# EAGLE design IN-16 Display (EAGLE 9.6.2)
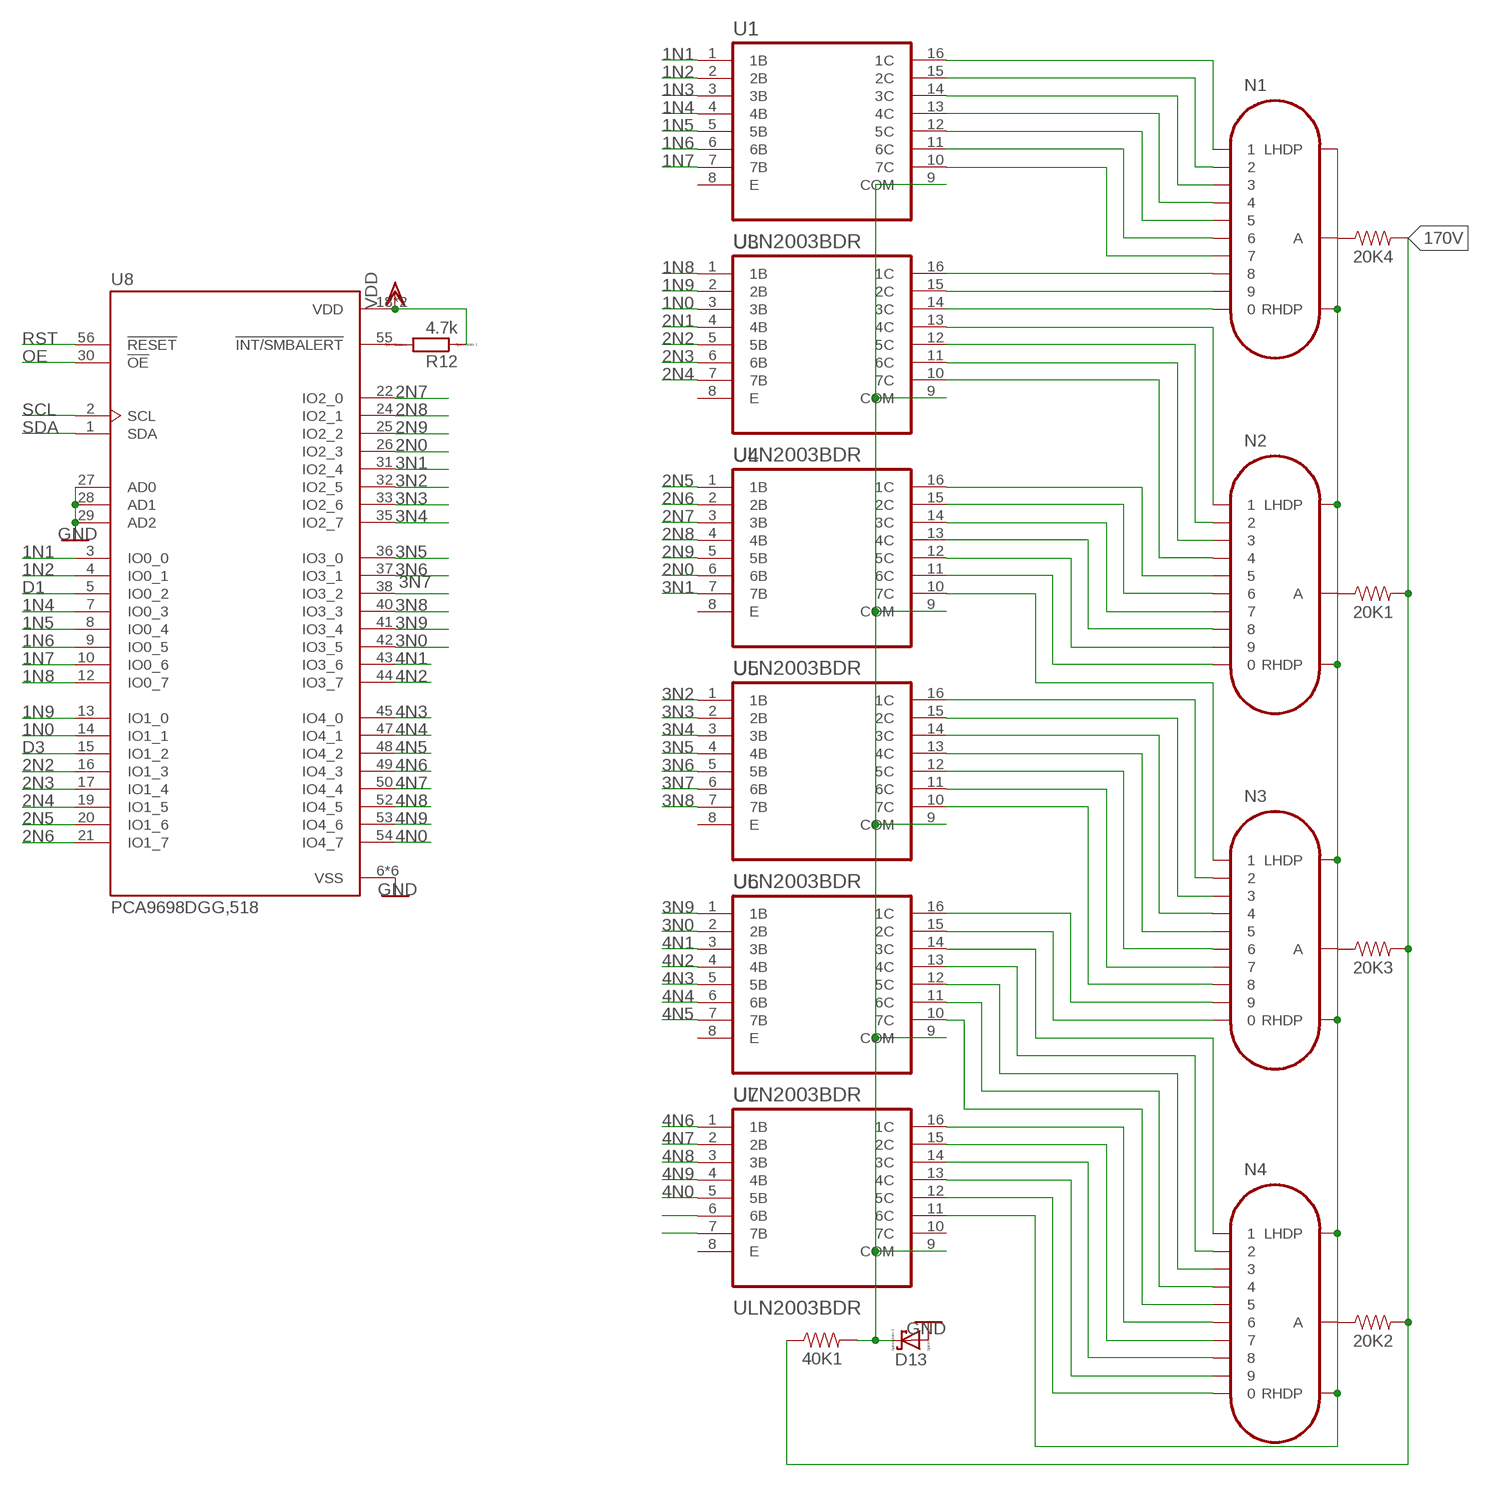
[diagram p0: schematic, sheet 1, part 1 of 2]
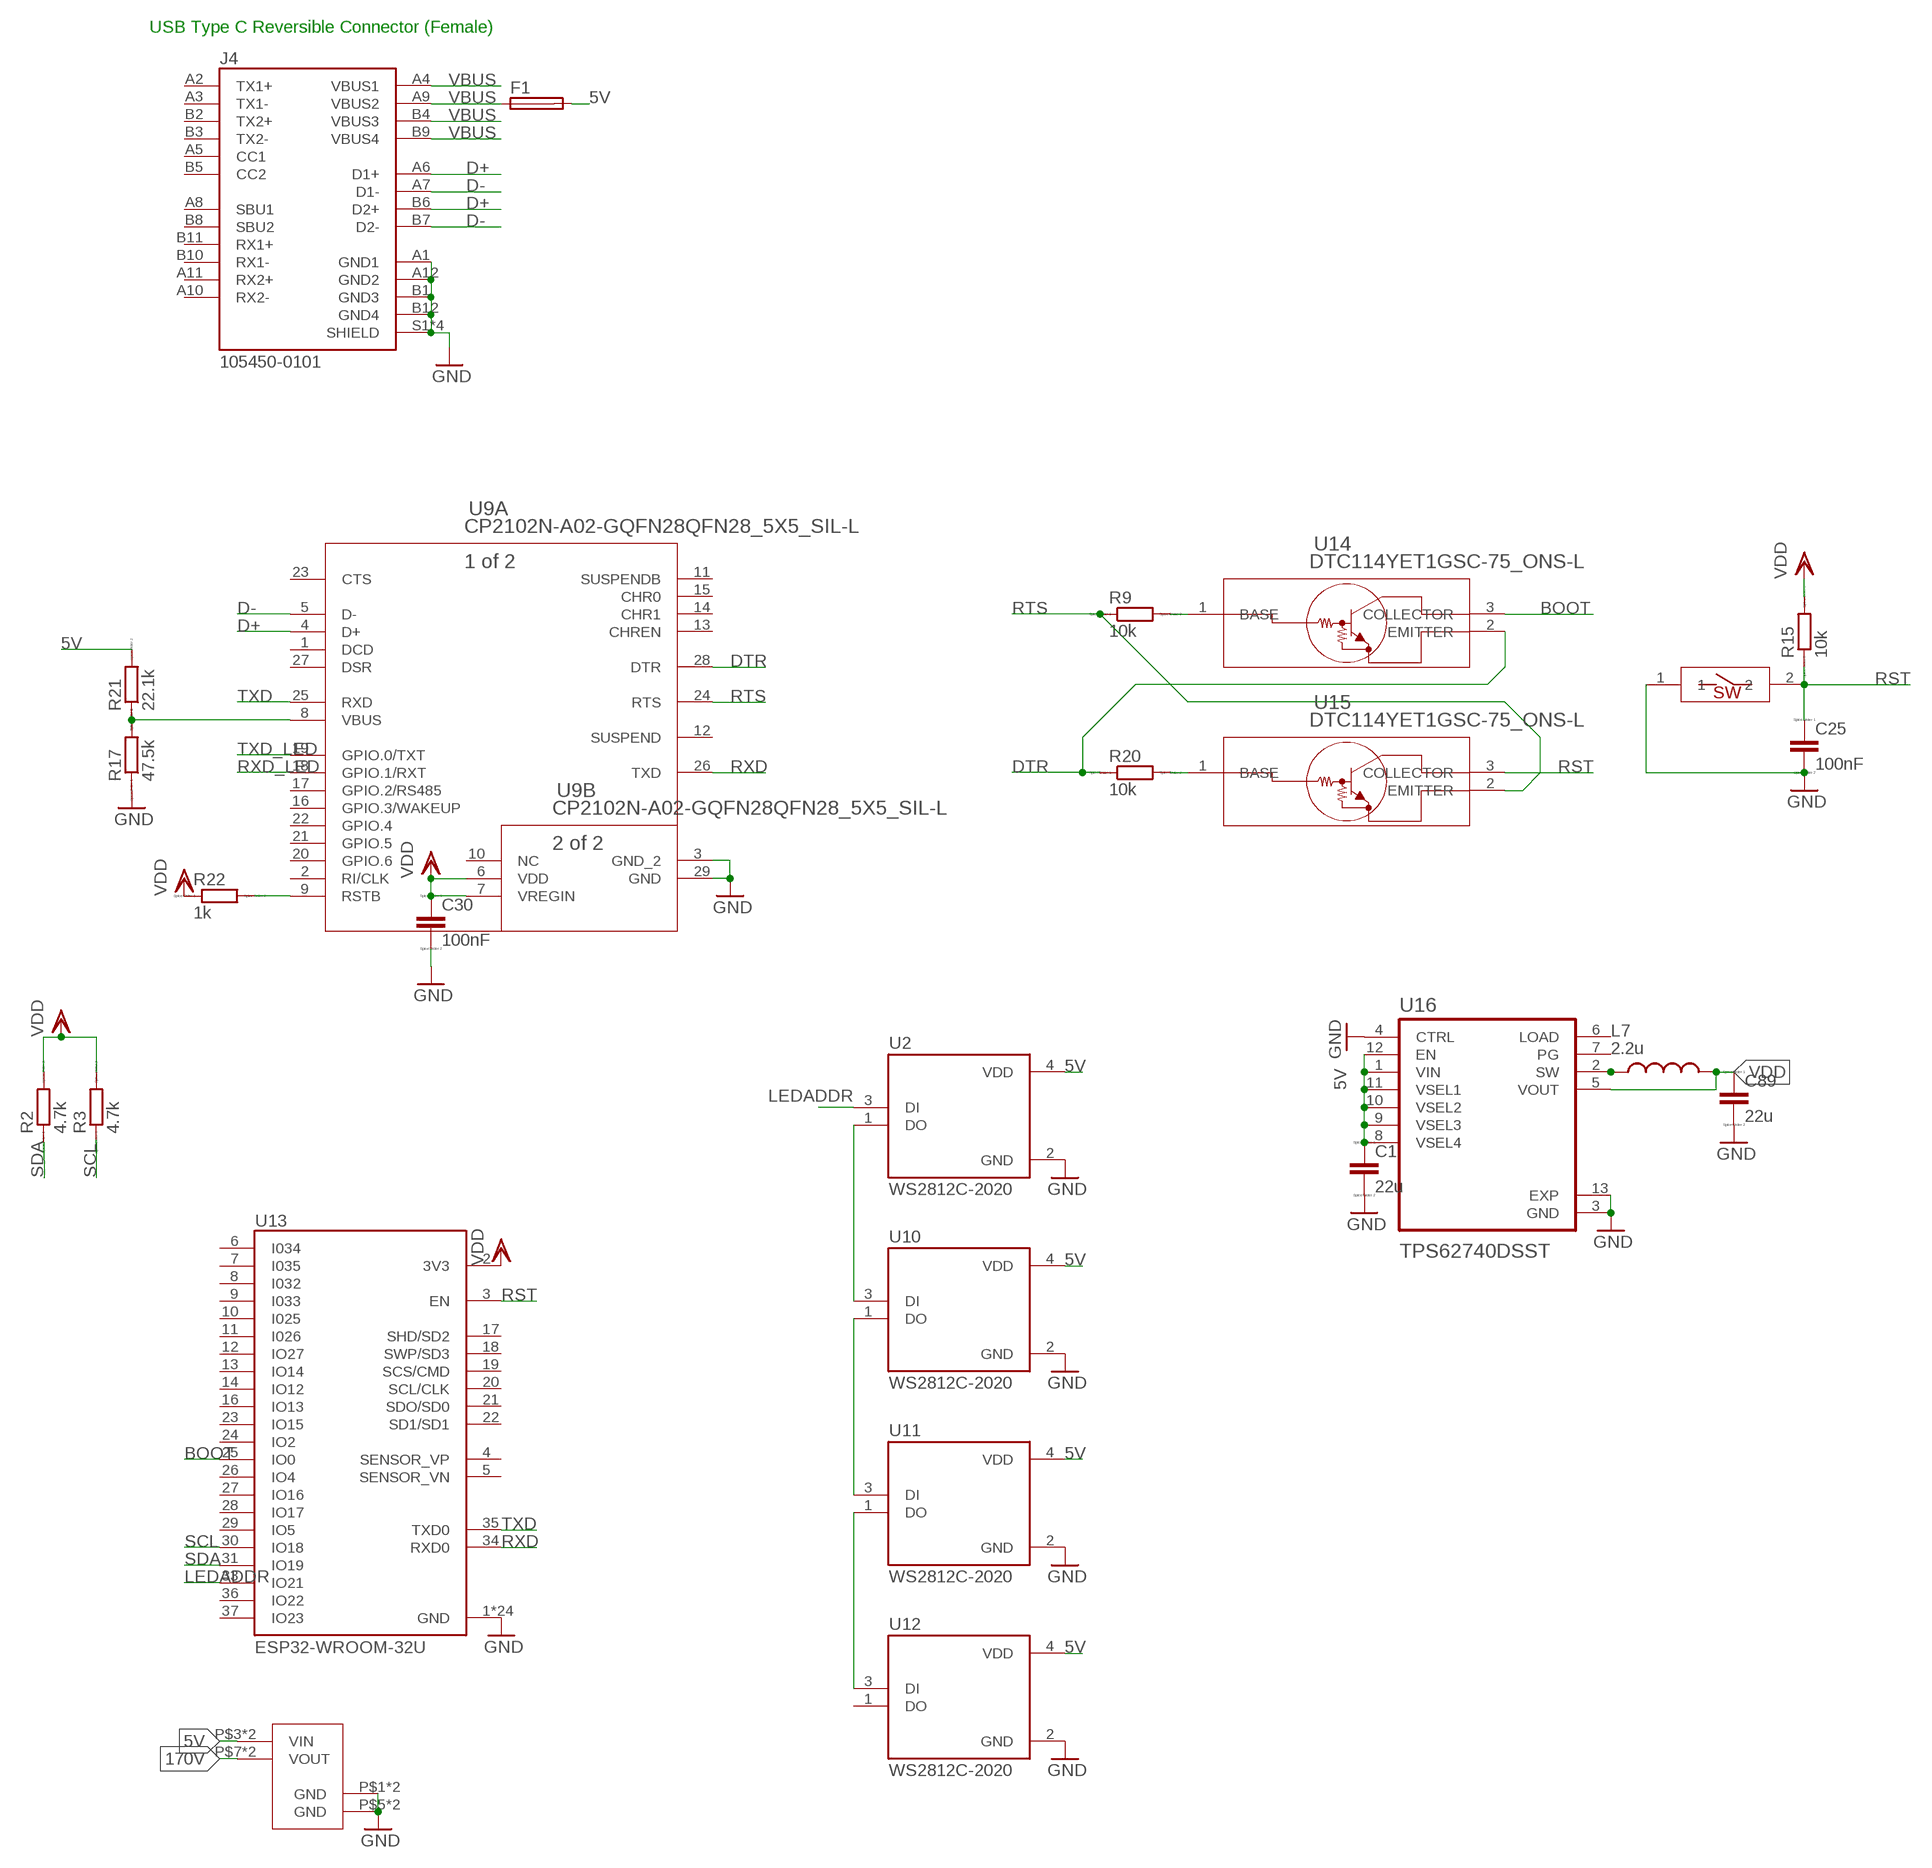
[diagram p1: schematic, sheet 1, part 2 of 2]

## Parts
20K1  0.05  0.1OHM-1210-1/2W-1%  [1210]
20K2  0.05  0.1OHM-1210-1/2W-1%  [1210]
20K3  0.05  0.1OHM-1210-1/2W-1%  [1210]
20K4  0.05  0.1OHM-1210-1/2W-1%  [1210]
40K1  0.05  0.1OHM-1210-1/2W-1%  [1210]
C1  22u  CC0603R  [C0603R]
C25  100nF  CC0402  [C0402]
C30  100nF  CC0402  [C0402]
C89  22u  CC0603R  [C0603R]
D13  SCHOTTKY-DIODE  [DIODE_SMB]
F1  MF-MSMF050-2  [1812]
J4  105450-0101  [MOLEX_105450-0101]
L7  2.2u  1277AS-H-1R5M=P2  [INDC3225X120N]
N1  IN-16  [IN-16]
N2  IN-16  [IN-16]
N3  IN-16  [IN-16]
N4  IN-16  [IN-16]
R2  4.7k  RR0402  [R0402]
R3  4.7k  RR0402  [R0402]
R9  10k  RR0402  [R0402]
R12  4.7k  RR0402  [R0402]
R15  10k  RR0402  [R0402]
R17  47.5k  RR0402  [R0402]
R20  10k  RR0402  [R0402]
R21  22.1k  RR0402  [R0402]
R22  1k  RR0402  [R0402]
RESET  SMDSWITCH  [RESC4217X170]
U1  ULN2003BDR  [SOIC127P600X175-16N]
U2  WS2812C-2020  [LED_WS2812C-2020]
U3  ULN2003BDR  [SOIC127P600X175-16N]
U4  ULN2003BDR  [SOIC127P600X175-16N]
U5  ULN2003BDR  [SOIC127P600X175-16N]
U6  ULN2003BDR  [SOIC127P600X175-16N]
U7  ULN2003BDR  [SOIC127P600X175-16N]
U8  PCA9698DGG,518  [SOP50P810X120-56N]
U9  CP2102N-A02-GQFN28QFN28_5X5_SIL-L  [QFN28_5X5_SIL-L]
U10  WS2812C-2020  [LED_WS2812C-2020]
U11  WS2812C-2020  [LED_WS2812C-2020]
U12  WS2812C-2020  [LED_WS2812C-2020]
U13  ESP32-WROOM-32U  [XCVR_ESP32-WROOM-32U]
U14  DTC114YET1GSC-75_ONS-L  [SC-75_ONS-L]
U15  DTC114YET1GSC-75_ONS-L  [SC-75_ONS-L]
U16  TPS62740DSST  [VREG_LM27762DSSR]
U$1  HVPSU  [HVPSU]

## Nets
1N0: U3.3(3B) U8.14(IO1_1)
1N1: U1.1(1B) U8.3(IO0_0)
1N2: U1.2(2B) U8.4(IO0_1)
1N3: U1.3(3B)
1N4: U1.4(4B) U8.7(IO0_3)
1N5: U1.5(5B) U8.8(IO0_4)
1N6: U1.6(6B) U8.9(IO0_5)
1N7: U1.7(7B) U8.10(IO0_6)
1N8: U3.1(1B) U8.12(IO0_7)
1N9: U3.2(2B) U8.13(IO1_0)
2N0: U4.6(6B) U8.26(IO2_3)
2N1: U3.4(4B)
2N2: U3.5(5B) U8.16(IO1_3)
2N3: U3.6(6B) U8.17(IO1_4)
2N4: U3.7(7B) U8.19(IO1_5)
2N5: U4.1(1B) U8.20(IO1_6)
2N6: U4.2(2B) U8.21(IO1_7)
2N7: U4.3(3B) U8.22(IO2_0)
2N8: U4.4(4B) U8.24(IO2_1)
2N9: U4.5(5B) U8.25(IO2_2)
3N0: U6.2(2B) U8.42(IO3_5)
3N1: U4.7(7B) U8.31(IO2_4)
3N2: U5.1(1B) U8.32(IO2_5)
3N3: U5.2(2B) U8.33(IO2_6)
3N4: U5.3(3B) U8.35(IO2_7)
3N5: U5.4(4B) U8.36(IO3_0)
3N6: U5.5(5B) U8.37(IO3_1)
3N7: U5.6(6B) U8.38(IO3_2)
3N8: U5.7(7B) U8.40(IO3_3)
3N9: U6.1(1B) U8.41(IO3_4)
4N0: U7.5(5B) U8.54(IO4_7)
4N1: U6.3(3B) U8.43(IO3_6)
4N2: U6.4(4B) U8.44(IO3_7)
4N3: U6.5(5B) U8.45(IO4_0)
4N4: U6.6(6B) U8.47(IO4_1)
4N5: U6.7(7B) U8.48(IO4_2)
4N6: U7.1(1B) U8.49(IO4_3)
4N7: U7.2(2B) U8.50(IO4_4)
4N8: U7.3(3B) U8.52(IO4_5)
4N9: U7.4(4B) U8.53(IO4_6)
5V: C1.1 F1.2 R21.2 U2.4(VDD) U10.4(VDD) U11.4(VDD) U12.4(VDD) U16.1(VIN) U16.8(VSEL4) U16.9(VSEL3) U16.10(VSEL2) U16.11(VSEL1) U16.12(EN) U$1.P$3(VIN) U$1.P$4(VIN)
170V: 20K1.2 20K2.2 20K3.2 20K4.2 40K1.1 U$1.P$7(VOUT) U$1.P$8(VOUT)
BOOT: U13.25(IO0) U14.3(COLLECTOR)
D1: U8.5(IO0_2)
D3: U8.15(IO1_2)
D+: J4.A6(D1+) J4.B6(D2+) U9.4(A:D+)
D-: J4.A7(D1-) J4.B7(D2-) U9.5(A:D-)
DTR: R20.1 U9.28(A:DTR) U14.2(EMITTER)
GND: C1.2 C25.2 C30.2 C89.2 D13.A(C) J4.A1(GND1) J4.A12(GND2) J4.B1(GND3) J4.B12(GND4) J4.S1(SHIELD) J4.S2(SHIELD) J4.S3(SHIELD) J4.S4(SHIELD) R17.1 RESET.1 U2.2(GND) U8.6(VSS) U8.11(VSS) U8.23(VSS) U8.27(AD0) U8.28(AD1) U8.29(AD2) U8.34(VSS) U8.39(VSS) U8.51(VSS) U9.3(B:GND_2) U9.29(B:GND) U10.2(GND) U11.2(GND) U12.2(GND) U13.1(GND) U13.15(GND) U13.38(GND) U13.G.1(GND) U13.G.2(GND) U13.G.4(GND) U13.G.5(GND) U13.G.6(GND) U13.G.7(GND) U13.G.8(GND) U13.G.9(GND) U13.G.10(GND) U13.G.11(GND) U13.G.12(GND) U13.G.13(GND) U13.G.14(GND) U13.G.15(GND) U13.G.16(GND) U13.G.17(GND) U13.G.18(GND) U13.G.19(GND) U13.G.20(GND) U13.G.21(GND) U13.G.22(GND) U16.3(GND) U16.4(CTRL) U16.13(EXP) U$1.P$1(GND) U$1.P$2(GND) U$1.P$5(GND) U$1.P$6(GND)
LEDADDR: U2.3(DI) U13.33(IO21)
N$2 [170V]: N1.1 U1.16(1C)
N$3 [170V]: N1.2 U1.15(2C)
N$4 [170V]: N1.3 U1.14(3C)
N$5 [170V]: N1.4 U1.13(4C)
N$6 [170V]: N1.5 U1.12(5C)
N$7 [170V]: N1.6 U1.11(6C)
N$8 [170V]: N1.7 U1.10(7C)
N$9 [170V]: N1.8 U3.16(1C)
N$10 [170V]: N1.9 U3.15(2C)
N$11 [170V]: N1.0 U3.14(3C)
N$12 [170V]: N2.1 U3.13(4C)
N$13 [170V]: N2.2 U3.12(5C)
N$14 [170V]: N2.3 U3.11(6C)
N$15 [170V]: N2.4 U3.10(7C)
N$16 [170V]: N2.5 U4.16(1C)
N$17 [170V]: N2.6 U4.15(2C)
N$18 [170V]: N2.7 U4.14(3C)
N$19 [170V]: N2.8 U4.13(4C)
N$20: 20K4.1 N1.A
N$21 [170V]: N2.9 U4.12(5C)
N$22 [170V]: N2.0 U4.11(6C)
N$23 [170V]: N3.1 U4.10(7C)
N$24 [170V]: N3.2 U5.16(1C)
N$25 [170V]: N3.3 U5.15(2C)
N$26 [170V]: N3.4 U5.14(3C)
N$27 [170V]: N3.5 U5.13(4C)
N$28 [170V]: N3.6 U5.12(5C)
N$29 [170V]: N3.7 U5.11(6C)
N$30 [170V]: N3.8 U5.10(7C)
N$31 [170V]: N3.9 U6.16(1C)
N$32 [170V]: N3.0 U6.15(2C)
N$33 [170V]: N4.1 U6.14(3C)
N$34 [170V]: N4.2 U6.13(4C)
N$35 [170V]: N4.3 U6.12(5C)
N$36 [170V]: N4.4 U6.11(6C)
N$37 [170V]: N4.5 U6.10(7C)
N$38: R20.2 U15.1(BASE)
N$39 [170V]: N4.6 U7.16(1C)
N$40 [170V]: N4.7 U7.15(2C)
N$41 [170V]: N4.8 U7.14(3C)
N$42 [170V]: N4.9 U7.13(4C)
N$43 [170V]: N4.0 U7.12(5C)
N$44: 20K1.1 N2.A
N$45: 20K2.1 N4.A
N$46: 20K3.1 N3.A
N$47: R17.2 R21.1 U9.8(A:VBUS)
N$48: R22.2 U9.9(A:RSTB)
N$49: R9.2 U14.1(BASE)
N$50: U2.1(DO) U10.3(DI)
N$51: U10.1(DO) U11.3(DI)
N$52: U11.1(DO) U12.3(DI)
N$53: N1.LHDP N1.RHDP N2.LHDP N2.RHDP N3.LHDP N3.RHDP N4.LHDP N4.RHDP U7.11(6C)
N$67 [170V]: 40K1.2 D13.C(A) U1.9(COM) U3.9(COM) U4.9(COM) U5.9(COM) U6.9(COM) U7.9(COM)
N$80: L7.1 U16.2(SW)
N$85: U7.6(6B)
N$86: U7.7(7B)
N$95: R12.2 U8.55(!INT/SMBALERT)
OE: U8.30(!OE)
RST: C25.1 R15.1 RESET.2 U8.56(!RESET) U13.3(EN) U15.3(COLLECTOR)
RTS: R9.1 U9.24(A:RTS) U15.2(EMITTER)
RXD: U9.26(A:TXD) U13.34(RXD0)
RXD_LED: U9.18(A:GPIO.1/RXT)
SCL: R3.1 U8.2(SCL) U13.30(IO18)
SDA: R2.1 U8.1(SDA) U13.31(IO19)
TXD: U9.25(A:RXD) U13.35(TXD0)
TXD_LED: U9.19(A:GPIO.0/TXT)
VBUS: F1.1 J4.A4(VBUS1) J4.A9(VBUS2) J4.B4(VBUS3) J4.B9(VBUS4)
VDD: C30.1 C89.1 L7.2 R2.2 R3.2 R12.1 R15.2 R22.1 U8.18(VDD) U8.46(VDD) U9.6(B:VDD) U9.7(B:VREGIN) U13.2(3V3) U16.5(VOUT)
Unconnected: J4.A2(TX1+) J4.A3(TX1-) J4.A5(CC1) J4.A8(SBU1) J4.A10(RX2-) J4.A11(RX2+) J4.B2(TX2+) J4.B3(TX2-) J4.B5(CC2) J4.B8(SBU2) J4.B10(RX1-) J4.B11(RX1+) U1.8(E) U3.8(E) U4.8(E) U5.8(E) U6.8(E) U7.8(E) U7.10(7C) U9.1(A:DCD) U9.2(A:RI/CLK) U9.10(B:NC) U9.11(A:SUSPENDB) U9.12(A:SUSPEND) U9.13(A:CHREN) U9.14(A:CHR1) U9.15(A:CHR0) U9.16(A:GPIO.3/WAKEUP) U9.17(A:GPIO.2/RS485) U9.20(A:GPIO.6) U9.21(A:GPIO.5) U9.22(A:GPIO.4) U9.23(A:CTS) U9.27(A:DSR) U12.1(DO) U13.4(SENSOR_VP) U13.5(SENSOR_VN) U13.6(I034) U13.7(I035) U13.8(I032) U13.9(I033) U13.10(I025) U13.11(I026) U13.12(IO27) U13.13(IO14) U13.14(IO12) U13.16(IO13) U13.17(SHD/SD2) U13.18(SWP/SD3) U13.19(SCS/CMD) U13.20(SCL/CLK) U13.21(SDO/SD0) U13.22(SD1/SD1) U13.23(IO15) U13.24(IO2) U13.26(IO4) U13.27(IO16) U13.28(IO17) U13.29(IO5) U13.36(IO22) U13.37(IO23) U16.6(LOAD) U16.7(PG)

## Notes on the sheet
- USB Type C Reversible Connector (Female)

## Library data of the parts
20K1-20K4 40K1 = SparkFun-Resistors:0.1OHM: 0.1Ω resistor A resistor is a passive two-terminal electrical component that implements electrical resistance as a circuit element. Resistors act to reduce current flow, and, at the same time, act to lower voltage levels within circuits. - Wikipedia; PROD_ID: RES-12374; VALUE: 0.1
C1 C89 = eagle-ltspice:C: CAPACITOR, European symbol
C25 C30 = eagle-ltspice:C: CAPACITOR, European symbol; SPICEMODEL: NONE; SPICEPREFIX: C
D13 = eagle-ltspice:SCHOTTKY-DIODE: Schottky Diode; SPICEMODEL: NONE; SPICEPREFIX: D; SPICETYPE: diode
F1 = Thermistor_Inductors:MF-MSMF050-2: PTC RESET FUSE 15V 500MA 1812 Manufacturer's datasheet <https://www.bourns.com/docs/Product-Datasheets/mfmsmf.pdf>; CREATED_BY: PCBLayout.com; DIGIKEY_PART_NUMBER: MF-MSMF050-2TR-ND; MANUFACTURER: Bourns Inc.; MPN: MF-MSMF050-2; PACKAGE: 1812
J4 = 105450-0101:105450-0101: USB Shielded I/O Receptacle; Type C; Right Angle; Surface Mount; Gold over Nickel; AVAILABILITY: Unavailable; DESCRIPTION: USB-C (USB TYPE-C) USB 3.1 (USB 3.1 Gen 2, Superspeed+) Receptacle Connector 24 Position Surface Mount, Right Angle; Through Hole; MF: Molex; MP: 1054500101; PACKAGE: None; PRICE: None
L7 = 1277AS-H-1R5M_P2:1277AS-H-1R5M=P2: Ind Metal Alloy Shielded 1.5uH 20% 1MHz Powdered Iron 2.6A 1210 T/R Check prices <https://pricing.snapeda.com/parts/1277AS-H-1R5M%3DP2/Murata/view-part?ref=eda>; AVAILABILITY: Warning; DESCRIPTION: Inductor with Inductance: 1.5uH Tol. +/-20%, Package: 1210 (3225); MF: Murata; MP: 1277AS-H-1R5M=P2; PACKAGE: 1210 Murata; PRICE: None; PURCHASE-URL: https://pricing.snapeda.com/search/part/1277AS-H-1R5M=P2/?ref=eda
N1-N4 = russian-nixies:IN-16: IN-16: small numeric frontview nixie tube
R2 R3 R9 R12 R15 R17 R20-R22 = eagle-ltspice:R: RESISTOR, European symbol; SPICEMODEL: NONE; SPICEPREFIX: R
RESET = SMD SWITCH:SMDSWITCH
U1 U3-U7 = ULN2003BDR:ULN2003BDR: Check prices <https://pricing.snapeda.com/parts/ULN2003BDR/Texas%20Instruments/view-part?ref=eda>; AVAILABILITY: In Stock; DESCRIPTION: 50-V, 7-ch darlington array with 3-V input capability and low cost 16-SOIC -40 to 105; MF: Texas Instruments; MP: ULN2003BDR; PACKAGE: SOIC-16 Texas Instruments; PRICE: None; PURCHASE-URL: https://pricing.snapeda.com/search/part/ULN2003BDR/?ref=eda
U2 U10-U12 = WS2812C-2020:WS2812C-2020: Intelligent control LED integrated light source Check prices <https://pricing.snapeda.com/parts/WS2812C-2020/Worldsemi/view-part?ref=eda>; AVAILABILITY: Not in stock; DESCRIPTION: Intelligent control LED integrated light source; MF: Worldsemi; MP: WS2812C-2020; PACKAGE: Package; PRICE: None
U8 = PCA9698DGG_518:PCA9698DGG,518: PCA9698 - 40-bit Fm+ I2C-bus advanced I/O port with RESET, OE and INT Check prices <https://pricing.snapeda.com/parts/PCA9698DGG%2C518/NXP%20USA/view-part?ref=eda>; AVAILABILITY: Warning; DESCRIPTION: I/O Expander 40 I²C 1MHz 56-TSSOP; MF: NXP USA; MP: PCA9698DGG,518; PACKAGE: TSSOP-56 NXP Semiconductors; PRICE: None; PURCHASE-URL: https://pricing.snapeda.com/search/part/PCA9698DGG,518/?ref=eda
U9 = CP2102N:CP2102N-A02-GQFN28; BUILT_BY: EMA_Cory; COPYRIGHT: Copyright (C) 2018 Accelerated Designs. All rights reserved; DATASHEET: https://www.silabs.com/documents/public/data-sheets/cp2102n-datasheet.pdf; MANUFACTURER_PART_NUMBER: CP2102N-A02-GQFN28; SOURCELIBRARY: Silicon_Labs_2020-02-14; VENDOR: Silicon Labs
U13 = ESP32-WROOM-32U:ESP32-WROOM-32U: Wi-Fi/BT BLE Module ESP32-D0WD SPI Flash UART U.FL Conn. Check prices <https://pricing.snapeda.com/parts/ESP32-WROOM-32U/Espressif%20Systems/view-part?ref=eda>; AVAILABILITY: In Stock; DESCRIPTION: Bluetooth, WiFi 802.11b/g/n, Bluetooth v4.2 +EDR, Class 1, 2 and 3 Transceiver Module 2.4GHz ~ 2.5GHz Antenna Not Included, U.FL Surface Mount; MF: Espressif Systems; MP: ESP32-WROOM-32U; PACKAGE: Module Espressif Systems; PRICE: None; PURCHASE-URL: https://pricing.snapeda.com/search/part/ESP32-WROOM-32U/?ref=eda
U14 U15 = DTC114YET1G:DTC114YET1G; BUILT_BY: EMA_Justin; COPYRIGHT: Copyright (C) 2018 Accelerated Designs. All rights reserved; DATASHEET: https://www.onsemi.com/pub/Collateral/DTC114Y-D.PDF; MANUFACTURER_PART_NUMBER: DTC114YET1G; SOURCELIBRARY: ON_Semiconductor_2020-01-13; VENDOR: ON Semiconductor
U16 = TPS62740DSST:TPS62740DSST: Check prices <https://pricing.snapeda.com/parts/TPS62740DSS/Texas%20Instruments/view-part?ref=eda>; AVAILABILITY: In Stock; DESCRIPTION: DCS-Control™ Converter, Bluetooth (BLT) Voltage Regulator IC 1 Output 12-WSON (3x2); MF: Texas Instruments; MP: TPS62740DSS; PACKAGE: WSON-12 Texas Instruments; PRICE: None; PURCHASE-URL: https://pricing.snapeda.com/search/part/TPS62740DSS/?ref=eda
U$1 = HVPSU:HVPSU

## Net classes
1 170V: width 0.3 mm, drill 0.3 mm, clearance 0.2 mm

## Board
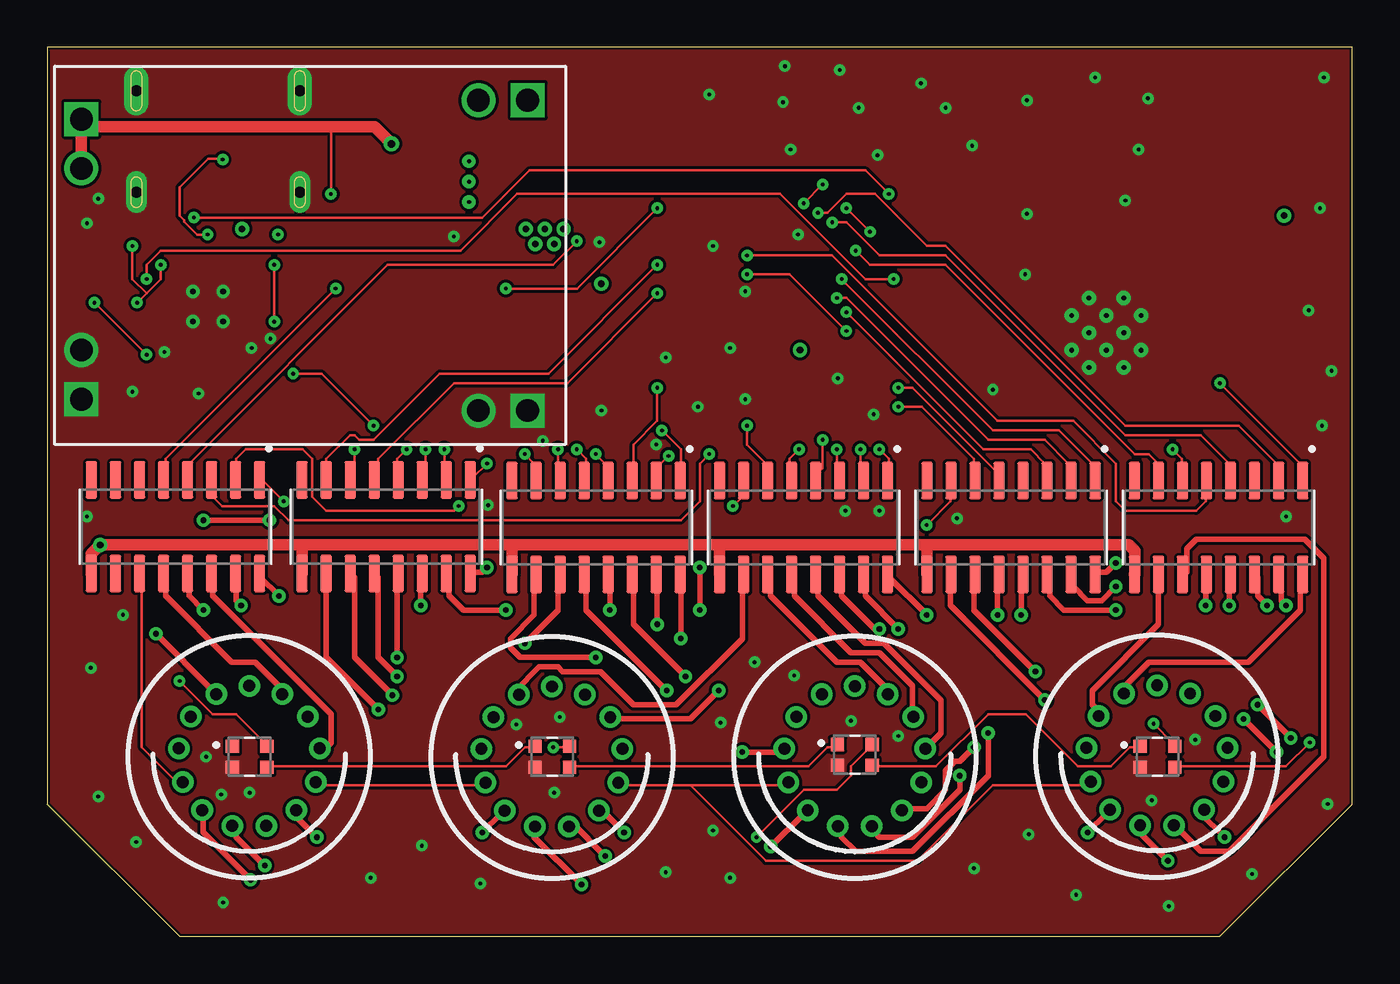
[diagram p2: board, top side]
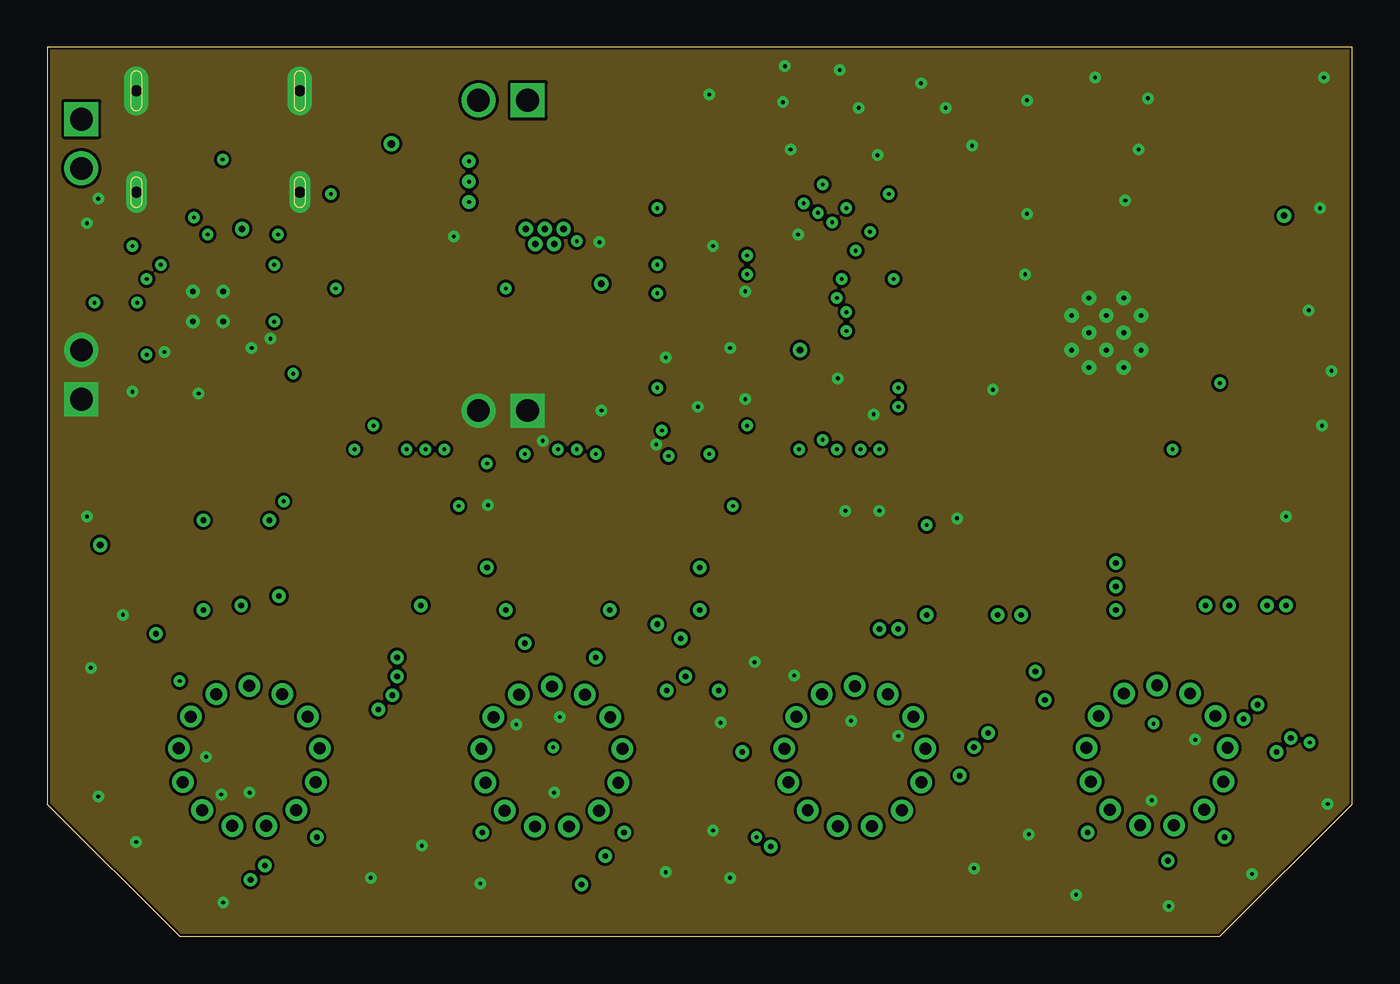
[diagram p3: board, inner layer Route2]
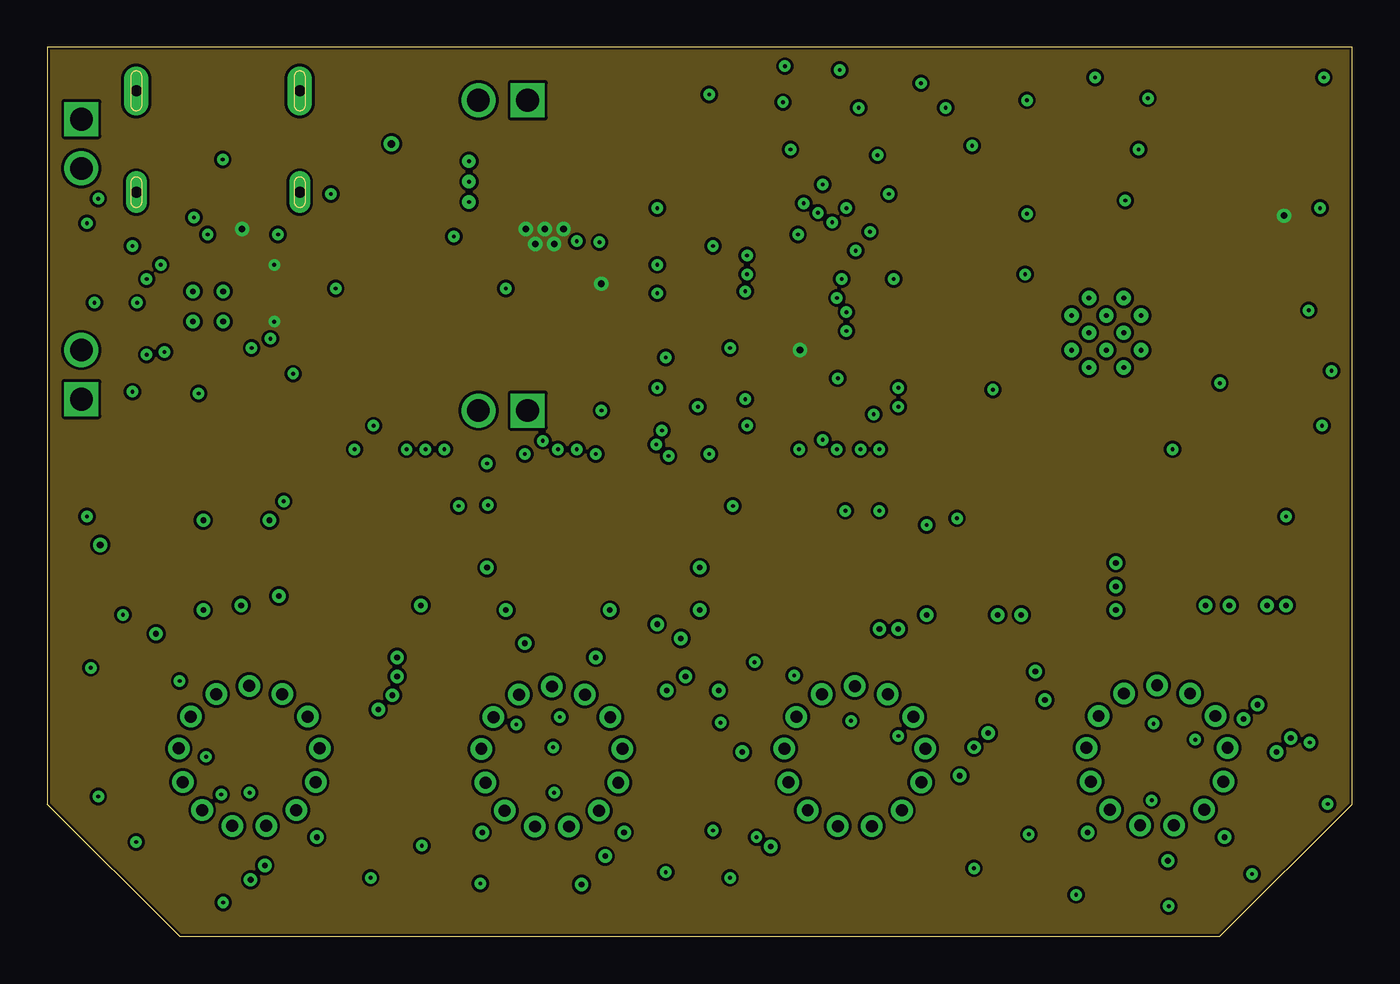
[diagram p4: board, inner layer Route15]
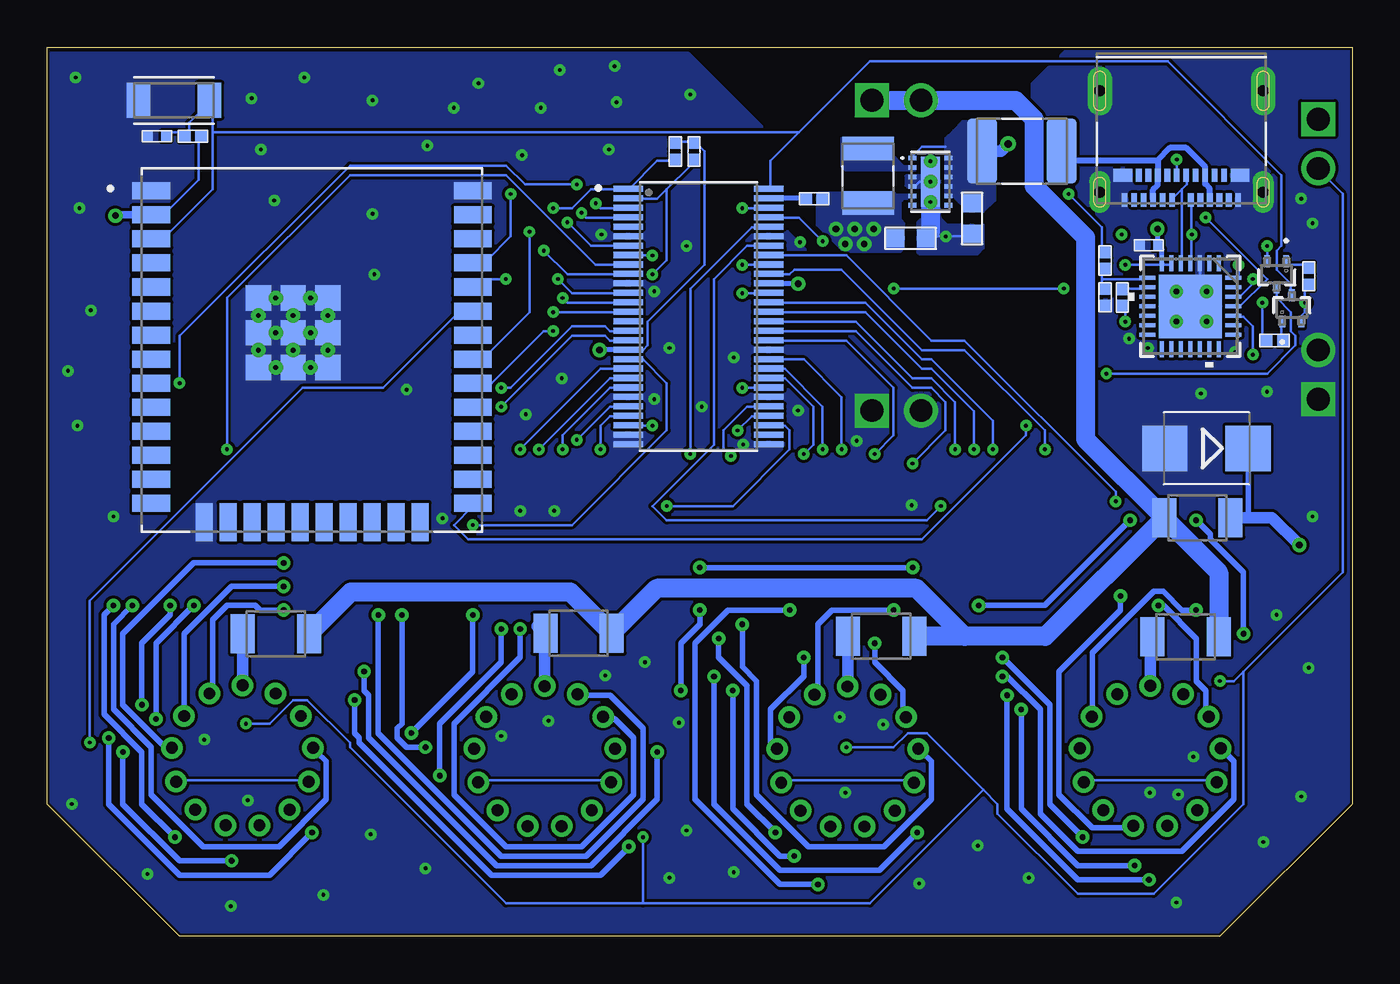
[diagram p5: board, bottom side, seen from below]

Size 69 x 47 mm. Coordinates in mm from the lower left corner, seen from the top.
Outline: 7,0 62,0 69,7 69,47 0,47 0,7 7,0
Copper layers (1+2*15+16): Top 0.035mm / dielectric 1.5mm / Route2 0.035mm / dielectric 0.15mm / Route15 0.035mm / dielectric 0.2mm / Bottom 0.035mm
Design rules "default *": minimum track width 5mil, minimum drill 0.2mm, track to track 6mil, track to pad 6mil, pad to pad 6mil, via to via 6mil, smd to smd 6mil, copper to edge 5mil, drill to drill 6mil, minimum pad ring 10mil, minimum via ring 8mil, stop-mask expansion 0mil, vias tented up to drill 40mil, thermal gap 0mil

### Footprints (pad centres in the part's own frame; a part is rotated, then mirrored left to right if it is on the bottom)
1210 = smd 1.27 x 2.06: 1 -1.755,0; 2 1.755,0
C0603R = smd 0.95 x 0.95: 1 -0.85,0; 2 0.75,0
C0402 = smd 0.5 x 0.5: 1 -0.475,0; 2 0.475,0
DIODE_SMB = smd 2.4 x 2.4: A 2.2,0; C -2.2,0
1812 = smd 1.58 x 3.43: 1 -2.1,0; 2 2.1,0
MOLEX_105450-0101 = smd 0.3 x 0.7: A1 -3,3.77; A2 -2.5,3.77; A3 -2,3.77; A4 -1.5,3.77; A5 -1,3.77; A6 -0.5,3.77; A7 0.5,3.77; A8 1,3.77; A9 1.5,3.77; A10 2,3.77; A11 2.5,3.77; A12 3,3.77; B2 2.25,2.47; B3 1.75,2.47; B4 1.25,2.47; B5 0.75,2.47; B6 0.25,2.47; B7 -0.25,2.47; B8 -0.75,2.47; B9 -1.25,2.47; B10 -1.75,2.47; B11 -2.25,2.47 | smd 1 x 0.7: B1 3.1,2.47; B12 -3.1,2.47 | drill 0.6 pad 1.1 long: S1 -4.32,3.36; S2 4.32,3.36 | drill 0.6 pad 1.3 long: S3 -4.32,-2; S4 4.32,-2
INDC3225X120N = smd 1.24 x 2.72: 1 -1.44,0; 2 1.44,0
IN-16 = drill 0.63: 0 -1.745,-3.325; 1 1.745,-3.325; 2 -2.49,2.81; 3 3.727,-0.453; 4 2.49,2.81; 5 0.898,3.645; 6 -0.898,3.645; 7 3.09,-2.133; 8 -3.727,-0.453; 9 -3.09,-2.133; A 0,-3.755; LHDP -3.511,1.331; RHDP 3.511,1.331
R0402 = smd 0.6 x 0.55: 1 -0.425,0; 2 0.425,0
RESC4217X170 = smd 1.254 x 1.829: 1 -1.875,0; 2 1.875,0
SOIC127P600X175-16N = smd 1.97 x 0.6: 1 -2.475,4.445; 2 -2.475,3.175; 3 -2.475,1.905; 4 -2.475,0.635; 5 -2.475,-0.635; 6 -2.475,-1.905; 7 -2.475,-3.175; 8 -2.475,-4.445; 9 2.475,-4.445; 10 2.475,-3.175; 11 2.475,-1.905; 12 2.475,-0.635; 13 2.475,0.635; 14 2.475,1.905; 15 2.475,3.175; 16 2.475,4.445
LED_WS2812C-2020 = smd 0.7 x 0.7: 1 -0.915,0.55; 2 -0.915,-0.55; 3 0.915,-0.55; 4 0.915,0.55
SOP50P810X120-56N = smd 1.59 x 0.29: 1 -3.715,6.75; 2 -3.715,6.25; 3 -3.715,5.75; 4 -3.715,5.25; 5 -3.715,4.75; 6 -3.715,4.25; 7 -3.715,3.75; 8 -3.715,3.25; 9 -3.715,2.75; 10 -3.715,2.25; 11 -3.715,1.75; 12 -3.715,1.25; 13 -3.715,0.75; 14 -3.715,0.25; 15 -3.715,-0.25; 16 -3.715,-0.75; 17 -3.715,-1.25; 18 -3.715,-1.75; 19 -3.715,-2.25; 20 -3.715,-2.75; 21 -3.715,-3.25; 22 -3.715,-3.75; 23 -3.715,-4.25; 24 -3.715,-4.75; 25 -3.715,-5.25; 26 -3.715,-5.75; 27 -3.715,-6.25; 28 -3.715,-6.75; 29 3.715,-6.75; 30 3.715,-6.25; 31 3.715,-5.75; 32 3.715,-5.25; 33 3.715,-4.75; 34 3.715,-4.25; 35 3.715,-3.75; 36 3.715,-3.25; 37 3.715,-2.75; 38 3.715,-2.25; 39 3.715,-1.75; 40 3.715,-1.25; 41 3.715,-0.75; 42 3.715,-0.25; 43 3.715,0.25; 44 3.715,0.75; 45 3.715,1.25; 46 3.715,1.75; 47 3.715,2.25; 48 3.715,2.75; 49 3.715,3.25; 50 3.715,3.75; 51 3.715,4.25; 52 3.715,4.75; 53 3.715,5.25; 54 3.715,5.75; 55 3.715,6.25; 56 3.715,6.75
QFN28_5X5_SIL-L = smd 0.864 x 0.203: 1 -2.273,1.5; 2 -2.273,1; 3 -2.273,0.5; 4 -2.273,0; 5 -2.273,-0.5; 6 -2.273,-1; 7 -2.273,-1.5; 15 2.273,-1.5; 16 2.273,-1; 17 2.273,-0.5; 18 2.273,0; 19 2.273,0.5; 20 2.273,1; 21 2.273,1.5 | smd 0.203 x 0.864: 8 -1.5,-2.273; 9 -1,-2.273; 10 -0.5,-2.273; 11 0,-2.273; 12 0.5,-2.273; 13 1,-2.273; 14 1.5,-2.273; 22 1.5,2.273; 23 1,2.273; 24 0.5,2.273; 25 0,2.273; 26 -0.5,2.273; 27 -1,2.273; 28 -1.5,2.273 | smd 3.353 x 3.353: 29 0,0
XCVR_ESP32-WROOM-32U = smd 2 x 0.9: 1 -8.5,8.41; 2 -8.5,7.14; 3 -8.5,5.87; 4 -8.5,4.6; 5 -8.5,3.33; 6 -8.5,2.06; 7 -8.5,0.79; 8 -8.5,-0.48; 9 -8.5,-1.75; 10 -8.5,-3.02; 11 -8.5,-4.29; 12 -8.5,-5.56; 13 -8.5,-6.83; 14 -8.5,-8.1; 25 8.5,-8.1; 26 8.5,-6.83; 27 8.5,-5.56; 28 8.5,-4.29; 29 8.5,-3.02; 30 8.5,-1.75; 31 8.5,-0.48; 32 8.5,0.79; 33 8.5,2.06; 34 8.5,3.33; 35 8.5,4.6; 36 8.5,5.87; 37 8.5,7.14; 38 8.5,8.41 | smd 0.9 x 2: 15 -5.715,-9.1; 16 -4.445,-9.1; 17 -3.175,-9.1; 18 -1.905,-9.1; 19 -0.635,-9.1; 20 0.635,-9.1; 21 1.905,-9.1; 22 3.175,-9.1; 23 4.445,-9.1; 24 5.715,-9.1 | smd 1.33 x 1.33: G.1 0.835,2.745; G.2 -1,2.745; G.4 -2.835,2.745; G.5 0.835,0.91; G.6 -1,0.91; G.7 -2.835,0.91; G.8 0.835,-0.925; G.9 -1,-0.925; G.10 -2.835,-0.925 | drill 0.254: G.11 -0.083,2.745; G.12 -1.917,2.745; G.13 0.835,1.827; G.14 -1,1.827; G.15 -2.835,1.827; G.16 -0.083,0.91; G.17 -1.917,0.91; G.18 0.835,-0.007; G.19 -1,-0.007; G.20 -2.835,-0.007; G.21 -0.083,-0.925; G.22 -1.917,-0.925
SC-75_ONS-L = smd 0.305 x 0.61: 1 -0.5,-0.699; 2 0.5,-0.699; 3 0,0.699
VREG_LM27762DSSR = smd 0.5 x 0.25: 1 -0.95,1.25; 2 -0.95,0.75; 3 -0.95,0.25; 4 -0.95,-0.25; 5 -0.95,-0.75; 6 -0.95,-1.25; 7 0.95,-1.25; 8 0.95,-0.75; 9 0.95,-0.25; 10 0.95,0.25; 11 0.95,0.75; 12 0.95,1.25 | smd 1 x 2.65: 13 0,0 | drill 0.2 pad 0.35: 13.1 0,1.075; 13.2 0,0; 13.3 0,-1.075
HVPSU = drill 1.2 square: P$1 1.4,2.4; P$3 1.4,17.2; P$5 25,1.8; P$7 25,18.2 | drill 1.2: P$2 1.4,5; P$4 1.4,14.6; P$6 22.4,1.8; P$8 22.4,18.2

### Placement (x,y rotation side)
20K1  40.91,16.02 0 bottom
20K2  8.81,15.84 0 bottom
20K3  24.91,15.86 0 bottom
20K4  56.91,16 0 bottom
40K1  8.19,22.14 0 bottom
C1  20.1,37.9 270 bottom
C25  63.2,42.3 180 bottom
C30  10.75,36.54 180 bottom
C89  23.3,36.9 0 bottom
D13  7.71,25.8 180 bottom
F1  17.47,41.51 180 bottom
J4  9.03,42.7 180 bottom
L7  25.6,40.2 270 bottom
N1  58.68,9.52 180 top
N2  42.7,9.48 180 top
N3  26.68,9.46 180 top
N4  10.68,9.49 180 top
R2  35.8,41.5 90 bottom
R3  34.8,41.5 90 bottom
R9  2.3,34.9 90 bottom
R12  28.45,38.99 180 bottom
R15  61.3,42.3 0 bottom
R17  13.06,33.79 90 bottom
R20  4.1,31.5 0 bottom
R21  13.06,35.73 90 bottom
R22  12.16,33.77 90 bottom
RESET  62.3,44.2 0 bottom
U1  61.93,21.62 270 top
U2  58.7,9.5 0 top
U3  50.96,21.62 270 top
U4  39.99,21.62 270 top
U5  29.02,21.62 270 top
U6  17.92,21.66 270 top
U7  6.78,21.66 270 top
U8  34.57,32.77 0 bottom
U9  8.56,33.31 270 bottom
U10  42.7,9.6 0 top
U11  26.7,9.5 0 top
U12  10.7,9.5 0 top
U13  55,31 0 bottom
U14  4,35 180 bottom
U15  3.2,33.2 0 bottom
U16  22.3,39.9 0 bottom
U$1  0.4,26 0 top

### Tracks (layer width: path | path; a pad name or v marks a point on that pad's centre or on a via)
1N0  (via drill 0.2)
  Top 0.127: v42.25,33 49.5,25.75 52,25.75 52.75,25 52.75,24.25 U3.3
  Bottom 0.127: v42.25,33 38.5,33 U8.14
1N1  (via drill 0.2)
  Top 0.127: v41,39.75 v40,38.75 | v62,29.25 66.25,25 66.25,24.25 U1.1
  Bottom 0.127: v40,38.75 39.75,38.5 38.5,38.5 U8.3 | v41,39.75 43.75,39.75 44.75,40.75 53,40.75 62,31.75 v62,29.25
1N2  (via drill 0.2)
  Top 0.127: v40.75,38.25 41.25,38.25 42.25,39.25 43.75,39.25 46.5,36.5 47.5,36.5 57,27 63,27 65,25 65,24.25 U1.2
  Bottom 0.127: v40.75,38.25 40.5,38 38.5,38 U8.4
1N4  (via drill 0.2)
  Top 0.127: v41.5,37.75 42.25,37.75 44,36 47.5,36 57,26.5 61,26.5 62.5,25 62.5,24.25 U1.4
  Bottom 0.127: v41.5,37.75 40.25,36.5 38.5,36.5 U8.7
1N5  (via drill 0.2)
  Top 0.127: v37,36 41.5,36 50.25,27.25 54.25,27.25 56.5,25 56.5,23 57,22.5 60.75,22.5 61.25,23 61.25,24 U1.5
  Bottom 0.127: v37,36 38.25,36 U8.8
1N6  (via drill 0.2)
  Top 0.127: v59.5,25.75 60,25.25 60,24.25 U1.6
  Bottom 0.127: v59.5,25.75 59.5,33.75 53,40.25 44.75,40.25 40,35.5 38.5,35.5 U8.9
1N7  (via drill 0.2)
  Top 0.127: v42.75,36.25 43.5,35.5 47.5,35.5 57.5,25.5 58.25,25.5 58.75,25 58.75,24.25 U1.7
  Bottom 0.127: v42.75,36.25 41.5,35 38.5,35 U8.10
1N8  (via drill 0.2)
  Top 0.127: v42,34.75 50,26.75 53.5,26.75 55.25,25 55.25,24.25 U3.1
  Bottom 0.127: v42,34.75 41.25,34 38.5,34 U8.12
1N9  (via drill 0.2)
  Top 0.127: v41.75,33.75 42.25,33.75 49.75,26.25 52.75,26.25 54,25 54,24.25 U3.2
  Bottom 0.127: v41.75,33.75 41.5,33.5 38.5,33.5 U8.13
2N0  (via drill 0.2)
  Top 0.127: v37,27 37,26 38,25 38,24.25 U4.6
  Bottom 0.127: v37,27 38.25,27 U8.26
2N2  (via drill 0.2)
  Top 0.127: v45,29 45.75,29 50.5,24.25 U3.5
  Bottom 0.127: v45,29 44.5,29 41.25,32.25 39.5,32.25 39.25,32 38.5,32 U8.16
2N3  (via drill 0.2)
  Top 0.127: v45,28 46.25,28 49,25.25 49,24.25 U3.6
  Bottom 0.127: v45,28 41.25,31.75 39.5,31.75 39.25,31.5 38.5,31.5 U8.17
2N4  (via drill 0.2)
  Top 0.127: v46.5,21.75 47.75,23 47.75,24 U3.7
  Bottom 0.127: v46.5,21.75 41.25,21.75 36.25,26.75 36.25,29.25 37.5,30.5 38.25,30.5 U8.19
2N5  (via drill 0.2)
  Top 0.127: v44,25.75 44.5,25.25 44.5,24.25 U4.1
  Bottom 0.127: v44,25.75 39.75,30 38.5,30 U8.20
2N6  (via drill 0.2)
  Top 0.127: v43,25.75 43,24.25 U4.2
  Bottom 0.127: v43,25.75 39.25,29.5 38.5,29.5 U8.21
2N7  (via drill 0.2)
  Top 0.127: v41.75,25.75 41.75,24.25 U4.3
  Bottom 0.127: v41.75,25.75 41.75,26.5 39.25,29 38.5,29 U8.22
2N8  (via drill 0.2)
  Top 0.127: v41,26.25 41,24.75 40.5,24.25 U4.4
  Bottom 0.127: v41,26.25 39.25,28 38.5,28 U8.24
2N9  (via drill 0.2)
  Top 0.127: v39.75,25.75 39.25,25.25 39.25,24.25 U4.5
  Bottom 0.127: v39.75,25.75 39.75,27 39.25,27.5 38.5,27.5 U8.25
3N0  (via drill 0.2)
  Top 0.127: v21,25.75 21,24.25 U6.2
  Bottom 0.127: v21,25.75 21,28.25 22.25,29.5 23.25,29.5 26.25,32.5 30.75,32.5 U8.42
3N1  (via drill 0.2)
  Top 0.127: v36.25,22.75 36.75,23.25 36.75,24 U4.7
  Bottom 0.127: v36.25,22.75 32.75,22.75 29.75,25.75 29.75,26.75 30,27 30.75,27 U8.31
3N2  (via drill 0.2)
  Top 0.127: v32.5,26.75 33.5,25.75 33.5,24.25 U5.1
  Bottom 0.127: v32.5,26.75 31.75,27.5 31,27.5 U8.32
3N3  (via drill 0.2)
  Top 0.127: v32.85,25.4 32.25,24.8 32.25,24.25 U5.2
  Bottom 0.127: v32.85,25.4 33.25,25.8 33.25,26.75 32,28 31,28 U8.33
3N4  (via drill 0.2)
  Top 0.127: v32.25,29 32.25,27.25 31,26 31,24.25 U5.3
  Bottom 0.127: v32.25,29 31,29 U8.35
3N5  (via drill 0.2)
  Top 0.127: v29,25.5 29.5,25 29.5,24.25 U5.4
  Bottom 0.127: v29,25.5 28.5,26 28.5,28 30,29.5 30.75,29.5 U8.36
3N6  (via drill 0.2)
  Top 0.127: v28,25.75 28.5,25.25 28.5,24.25 U5.5
  Bottom 0.127: v28,25.75 28,28 30,30 30.75,30 U8.37
3N7  (via drill 0.2)
  Top 0.127: v27,25.75 27,24.25 U5.6
  Bottom 0.127: v27,25.75 27,28.5 29,30.5 30.75,30.5 U8.38
3N8  (via drill 0.2)
  Top 0.127: v25.25,25.5 25.75,25 25.75,24.25 U5.7
  Bottom 0.127: v25.25,25.5 24.25,26.5 24.25,29 26.75,31.5 30.75,31.5 U8.40
3N9  (via drill 0.2)
  Top 0.127: v23.25,25 22.5,24.25 U6.1
  Bottom 0.127: v23.25,25 21.5,26.75 21.5,28.25 22.25,29 23.25,29 26.25,32 30.75,32 U8.41
4N0  (via drill 0.2)
  Top 0.127: v32.25,38.5 28,34.25 v24.25,34.25 | v15.25,34.25 6.25,25.25 6.25,24.25 U7.5
  Bottom 0.127: v32.25,38.5 31,38.5 U8.54 | v15.25,34.25 v24.25,34.25
4N1  (via drill 0.2)
  Top 0.127: v20,25.75 20,24.25 U6.3
  Bottom 0.127: v20,25.75 20,27.75 22.25,30 22.75,30 25.75,33 30.75,33 U8.43
4N2  (via drill 0.2)
  Top 0.127: v19,25.75 18.5,25.25 18.5,24.25 U6.4
  Bottom 0.127: v19,25.75 19,27.25 22.25,30.5 22.75,30.5 25.75,33.5 30.75,33.5 U8.44
4N3  (via drill 0.2)
  Top 0.127: v32.25,34 27.5,29.25 21.5,29.25 17.5,25.25 17.5,24.25 U6.5
  Bottom 0.127: v32.25,34 31,34 U8.45
4N4  (via drill 0.2)
  Top 0.127: v16.25,25.75 16.25,24.25 U6.6
  Bottom 0.127: v16.25,25.75 16.25,26.75 20.5,31 22.75,31 27,35.25 29.5,35.25 29.75,35 30.75,35 U8.47
4N5  (via drill 0.2)
  Top 0.127: v32.25,35.5 26.5,29.75 20.75,29.75 17.25,26.25 16.5,26.25 16.25,26.5 16,26.5 14.75,25.25 14.75,24.25 U6.7
  Bottom 0.127: v32.25,35.5 31,35.5 U8.48
4N6  (via drill 0.2)
  Top 0.127: v12.5,23 11.25,24.25 U7.1
  Bottom 0.127: v12.5,23 12.5,23.5 20.5,31.5 22.25,31.5 26.75,36 30.75,36 U8.49
4N7  (via drill 0.2)
  Top 0.127: v21.75,22.75 21.5,22.5 14.75,22.5 14,23.25 14,25.25 13.5,25.75 10.5,25.75 10,25.25 10,24.25 U7.2
  Bottom 0.127: v21.75,22.75 22.5,22 36.25,22 37,22.75 33.75,26 33.75,34.75 32,36.5 31,36.5 U8.50
4N8  (via drill 0.2)
  Top 0.127: v35,25.5 34.5,25 34.5,23 33.5,22 12.75,22 12,22.75 9.25,22.75 8.75,23.25 8.75,24 U7.3
  Bottom 0.127: v35,25.5 35,34.25 31.75,37.5 31,37.5 U8.52
4N9  (via drill 0.2)
  Top 0.127: v28,36.75 26.75,35.5 18,35.5 7.5,25 7.5,24.25 U7.4
  Bottom 0.127: v28,36.75 29.25,38 30.75,38 U8.53
5V  (via drill 0.2, 0.4)
  Top 0.127: 15,42.8 v15,39.25 | v7,13.5 8.75,11.75 10,11.75 11.5,10.25 U12.4 | v26.75,10 27.5,10 U11.4 | v58.5,11.25 59.5,10.25 U2.4 | v37.5,5.25 40,7.75 41.75,7.75 42.5,8.5 42.5,9 43.5,10 U10.4
  Top 0.61: v18.2,41.9 17.3,42.8 15,42.8 2.2,42.8 | 2.2,42.8 U$1.P$3 U$1.P$4 1.8,42.4 2.2,42.8
  Bottom 0.127: 21.5,41.75 22.75,41.75 23.25,41.25 U16.1 | v15,39.25 13.25,37.5 13.25,36.25 R21.2 | v7,13.5 6.25,13.5 5.75,14 | 5.75,14 0.5,19.25 0.5,39.25 1.75,40.5 U$1.P$4 | v26.75,10 24.25,10 23.5,10.75 22.5,10.75 19.5,7.75 | 19.5,7.75 18.75,7 18.75,6.5 14.5,2.25 10.5,2.25 5.75,7 5.75,14 | v58.5,11.25 57.25,11.25 56,12.5 55.25,12.5 53,10.25 53,10 44.75,1.75 37.5,1.75 | 37.5,1.75 25.5,1.75 19.5,7.75 | 37.5,1.75 v37.5,5.25
  Bottom 0.61: F1.2 18.59,41.51 v18.2,41.9
  pour Bottom: 18.9,39.9 18.9,43.1 20.6,43.1 21.1,42.6 21.5,42.2 21.5,39.1 21.1,39.1 20.8,38.8 20.3,38.3 19.9,38.3 19.5,38.3 18.9,38.9
170V
  Bottom 1.016: U$1.P$7 U$1.P$8 17.8,44.2 16.82,43.22 16.82,39.67 14.1,36.95 14.1,26.3 40K1.1 | 40K1.1 7.05,19.25 20K2.2 | 40K1.1 16.23,15.86 20.5,15.86 | 20.5,15.86 20K3.2 | 20.5,15.86 23.04,18.4 36.77,18.4 20K1.2 41.34,18.2 52.95,18.2 20K4.2
BOOT  (via drill 0.2)
  Top 0.127: v13,29.75 14.5,29.75 v17.25,27
  Bottom 0.127: U14.3 4,33.75 3.25,33 3.25,32 3,31.75 3,31.25 4.5,29.75 v13,29.75 | v17.25,27 17.25,26.5 22.75,21 46.75,21 47.5,21.75 46.5,22.75 U13.25
D+  (via drill 0.2)
  Top 0.127: v8.48,37.1 7.92,37.1 7.23,37.78 7.23,37.87 7,38.1 7,39.6 8.5,41.1 9.25,41.1 v9.28,41.07
  Bottom 0.127: 8.5,37.1 8.5,35.75 U9.4 | 8.5,37.1 8.5,38.75 J4.A6 | 8.5,37.1 v8.48,37.1 | v9.28,41.07 J4.B6
D-
  Bottom 0.127: 9,39.5 9.5,39 J4.A7 | 9,39.5 8.75,39.75 8.75,40 J4.B7 | 9,39.5 9,35.75 U9.5
DTR  (via drill 0.2)
  Top 0.127: 5.25,34 6,34.75 v6,35.5 | 5.25,34 v4.75,33.5 | v4.5,36.5 4.5,34.75 5.25,34
  Bottom 0.127: v4.75,33.5 4.75,31.5 R20.1 | v6,35.5 6,35 6.25,34.75 U9.28 | v4.5,36.5 U14.2
GND  (via drill 0.2, 0.3)
  Bottom 0.127: C1.2 20.25,37 v21.5,37 22.3,37 22.5,37 C89.2 | U16.13 22.88,39.9
  Bottom 0.152: U9.3 8.06,34.46 v7.7,34.1 | U9.29 9.3,32.57 v9.3,32.5 | U16.4 23.13,39.65 22.88,39.9
  Bottom 0.508: 22.3,37.3 22.3,37
  Bottom 1.016: U16.13 22.3,37.3
  other vias: 29.2,36.7 29.3,27.8 39.7,37.1 36.9,34.1 47.5,43.8 46.2,45.1 42.9,43.8 41.9,45.8 39,46 38.9,44.1 51.7,35 39.3,41.6 35,44.5 51.8,44.2 51.8,38.2 57.7,41.6 57,38.9 43.9,41.3 55.4,45.4 66.7,33.1 48.9,41.8 58.2,44.3 2.3,14.2 2.1,22.2 10.7,7.6 35.2,5.6 8.4,9.5 35.6,11.3 24.8,11.2 26.2,26.2 35.2,36.5 4.5,28.8 36.1,31.1 8,28.7 48.1,22.1 34.4,28 2.7,39 32.7,30.6 65.5,22.2 4.7,5 19.8,4.8 9.3,1.8 17.1,3.1 2.1,37.7 37.4,14.5 39.5,13.8 22.9,2.8 26.8,7.6 27.1,11.6 32.7,3.4 54.4,2.2 42.5,11.4 50,28.9 67.9,29.9 67.4,27 51.9,5.4 67.3,38.5 67.5,45.4 63.7,3.3 60.7,10.4 67.7,7 49,3.6 2.7,7.4 4,17 36.1,3.1 59.3,1.6 23.3,22.8 9.2,7.5 45,10.6 58.4,7.2 9.3,34.1 7.7,32.5 36.9,28.4 6.2,30.9 11.8,31.6 10.8,31.1 44,22.5 42.2,22.5 43.7,27.6 41.8,29.5 32.2,26
  pour Top: -0.1,-0.3 -0.1,46.9 69.2,46.9 69.2,-0.3
  pour Route2: -0.1,47.1 69.1,47.1 69.1,-0.2 -0.1,-0.2
  pour Bottom: 0.4,-0.2 69.1,-0.2 69.1,46.7 35.1,46.7 29.9,41.5 29.9,37.3 27.4,34.8 20.8,34.8 16.9,38.7 16.9,45.1 15.1,46.9 -0.1,46.9 -0.1,0.3
  pour Bottom: 19.5,37.6 21.4,37.6 21.8,38 21.8,41.2 22.7,41.2 22.7,40.3 22.8,40.2 23.6,40.2 23.6,39.7 23.5,39.6 22.8,39.6 22.7,39.6 22.7,38 22.9,37.8 23,37.7 23,36.2 22.9,36.1 19.8,36.1 19.5,36.4
GND1  (via drill 0.2)
  other vias: 12.2,37.1
LEDADDR  (via drill 0.2)
  Top 0.127: v66.75,10.25 65.5,9 59.75,9 U2.3
  Bottom 0.127: v66.75,10.25 66.75,17.75 55.5,29 51.25,29 47.25,33 46.5,33 U13.33
N$2
  Top 0.3: U1.16 66.25,19 66.25,17.25 63.5,14.5 58.25,14.5 56.75,13 N1.1
N$3  (via drill 0.3)
  Top 0.3: v65.5,17.5 65.25,17.75 65.25,19 U1.15 | v62.25,5.25 61,6.5 N1.2
  Bottom 0.3: v65.5,17.5 66,17 66,11.75 64,9.75 64,7 v62.25,5.25
N$4  (via drill 0.3)
  Top 0.3: v64.5,17.5 64,18 64,19 U1.14
  Bottom 0.3: v64.5,17.5 65.5,16.5 65.5,12 63.5,10 63.5,7.5 60.75,4.75 56.75,4.75 54.25,7.25 54.25,9.25 54.75,9.75 N1.3
N$5  (via drill 0.3)
  Top 0.3: v62.5,17.5 62.5,19 U1.13 | v65.75,10.5 v64,12.25 | v55,5.5 56,6.5 N1.4
  Bottom 0.3: v62.5,17.5 62.5,17 64,15.5 v64,12.25 | v65.75,10.5 65.75,7 62,3.25 57.25,3.25 v55,5.5
N$6  (via drill 0.3)
  Top 0.3: v61.25,17.5 61.25,19 U1.12 | v65,9.75 v63.25,11.5 | v59.25,4 57.75,5.5 57.75,5.75 N1.5
  Bottom 0.3: v61.25,17.5 63.25,15.5 v63.25,11.5 | v65,9.75 65,7 62,4 v59.25,4
N$7
  Top 0.3: U1.11 60.25,19.25 60.25,20.5 60.75,21 66.5,21 67.5,20 67.5,9.5 62.5,4.5 61,4.5 59.75,5.75 N1.6
N$8
  Top 0.3: U1.10 58.75,19 58.75,16.5 55.25,13 55.25,12.25 55.75,11.75 N1.7
N$9  (via drill 0.3)
  Top 0.3: v56.5,19.75 56,19.25 55.5,19.25 U3.16
  Bottom 0.3: v56.5,19.75 61.25,19.75 65,16 65,12.25 62.5,9.75 N1.8
N$10  (via drill 0.3)
  Top 0.3: v56.5,18.5 55.75,17.75 55,17.75 54.25,18.5 54.25,19 U3.15
  Bottom 0.3: v56.5,18.5 59.25,18.5 61.75,16 61.75,11.75 N1.9
N$11  (via drill 0.3)
  Top 0.3: v56.5,17.25 53.75,17.25 53,18 53,19 U3.14
  Bottom 0.3: v56.5,17.25 57.75,17.25 58,17.5 59.5,17.5 60.25,16.75 60.25,13 N1.0
N$12  (via drill 0.3)
  Top 0.3: v51.5,17 51.5,19 U3.13
  Bottom 0.3: v51.5,17 51.5,10.75 45,4.25 40.5,4.25 37.5,7.25 37.5,11 39.25,12.75 40.75,12.75 N2.1
N$13  (via drill 0.3)
  Top 0.3: v50.25,17 50.25,19 U3.12 | v49,10 48.25,9.25 48,9.25 47.5,8.75 47.5,7.75 46.5,6.75 45.25,6.75 N2.2
  Bottom 0.3: v50.25,17 50.25,11.25 50.5,11 50.5,10.5 50,10 v49,10
N$14  (via drill 0.3)
  Top 0.3: v52.25,14 49,17.25 49,19 U3.11 | v36.75,9.75 38.75,9.75 N2.3
  Bottom 0.3: v52.25,14 52.25,13 52,12.75 52,10.5 45.25,3.75 40.25,3.75 36.75,7.25 v36.75,9.75
N$15  (via drill 0.3)
  Top 0.3: v52.75,12.5 47.75,17.5 47.75,19 U3.10 | v38.25,4.75 40,6.5 N2.4
  Bottom 0.3: v52.75,12.5 52.75,10.75 52.5,10.5 52.5,10.25 45.5,3.25 39.75,3.25 v38.25,4.75
N$16  (via drill 0.3)
  Top 0.3: v46.5,17 44.5,19 U4.16 | v49.75,10.75 49.75,8.5 45.75,4.5 42.75,4.5 42,5.25 42,5.75 N2.5
  Bottom 0.3: v46.5,17 46.5,14 v49.75,10.75
N$17  (via drill 0.3)
  Top 0.3: v45,16.25 43.25,18 43.25,19 U4.15 | v48.25,8.5 48.25,7.75 45.75,5.25 44,5.25 43.5,5.75 N2.6
  Bottom 0.3: v45,16.25 45,14.5 48.25,11.25 v48.25,8.5
N$18  (via drill 0.3)
  Top 0.3: v44,16.25 43.75,16.25 42,18 42,19 U4.14
  Bottom 0.3: v44,16.25 44,14.75 47.5,11.25 47.5,7.5 44.75,4.75 40.75,4.75 38,7.5 38,10.5 39,11.5 39.5,11.5 N2.7
N$19
  Top 0.3: U4.13 40.75,19 40.75,18 43.25,15.5 44.25,15.5 47.25,12.5 47.25,10.75 46.5,10 N2.8
N$20
  Bottom 0.61: N1.A 58.68,15.98 20K4.1
N$21
  Top 0.3: U4.12 39.5,19 39.5,18 42.5,15 44,15 45.75,13.25 45.75,11.75 N2.9
N$22
  Top 0.3: U4.11 38.25,19 38.25,18 41.75,14.5 43,14.5 44.5,13 N2.0
N$23
  Top 0.3: U4.10 36.75,19 36.75,15.75 33.25,12.25 31,12.25 29.25,14 27.25,14 27,14.25 26,14.25 24.75,13 N3.1
N$24  (via drill 0.3)
  Top 0.3: v33.5,15.75 33.5,19 U5.16 | v30.5,5.5 29.25,6.75 N3.2
  Bottom 0.3: v33.5,15.75 33.5,14.75 32,13.25 32,7 v30.5,5.5
N$25  (via drill 0.3)
  Top 0.3: v32.25,16.5 32.25,19 U5.15
  Bottom 0.3: v32.25,16.5 32.25,14.25 31.5,13.5 31.5,7.5 28.75,4.75 24.75,4.75 22.25,7.25 22.25,9.25 22.75,9.75 N3.3
N$26  (via drill 0.3)
  Top 0.3: v33.75,13.75 31,16.5 31,19 U5.14 | v23,5.5 24,6.5 N3.4
  Bottom 0.3: v33.75,13.75 33.75,7 30.25,3.5 25,3.5 v23,5.5
N$27  (via drill 0.3)
  Top 0.3: v29.75,17.25 29.75,19 U5.13 | v28.25,2.75 25.75,5.25 25.75,5.75 N3.5
  Bottom 0.3: v29.75,17.25 33,17.25 34.75,15.5 34.75,7.25 30.25,2.75 v28.25,2.75
N$28  (via drill 0.3)
  Top 0.3: v32.75,13 28.5,17.25 28.5,19 U5.12 | v29.5,4.25 27.75,6 N3.6
  Bottom 0.3: v32.75,13 32.75,6.75 30.25,4.25 v29.5,4.25
N$29  (via drill 0.3)
  Top 0.3: v25.25,15.5 27,17.25 27,19 U5.11
  Bottom 0.3: v25.25,15.5 25.25,14.5 23.75,13 23.75,11.75 N3.7
N$30  (via drill 0.3)
  Top 0.3: v29,14.75 25,14.75 24.5,15.25 24.5,15.75 25.75,17 25.75,19 U5.10
  Bottom 0.3: v29,14.75 29,13.75 30.75,12 30.75,10.25 30.5,10 N3.8
N$31  (via drill 0.3)
  Top 0.3: v23.25,19.5 23,19.25 22.5,19.25 U6.16 | v34.5,17.25 v34.5,19.5 | v35.5,13 34,11.5 30,11.5 N3.9
  Bottom 0.3: v34.5,19.5 v23.25,19.5 | v34.5,17.25 34.5,16.5 35.5,15.5 v35.5,13
N$32  (via drill 0.3)
  Top 0.3: v24.25,17.25 22,17.25 21.25,18 21.25,19 U6.15
  Bottom 0.3: v24.25,17.25 27.5,17.25 28.25,16.5 28.25,13 N3.0
N$33  (via drill 0.3)
  Top 0.3: v19.75,17.5 19.75,19 U6.14 | v8.25,22 v11.75,22 | v5.75,16 8.75,13 N4.1
  Bottom 0.3: v19.75,17.5 16.25,17.5 v11.75,22 | v8.25,22 7.5,21.25 7.5,21 5.75,19.25 v5.75,16
N$34  (via drill 0.3)
  Top 0.3: v18.5,14.75 18.5,19 U6.13 | v14.25,5.25 13,6.5 N4.2
  Bottom 0.3: v18.5,14.75 16,12.25 16,7 v14.25,5.25
N$35  (via drill 0.3)
  Top 0.3: v18.5,13.75 17.5,14.75 17.5,19 U6.12
  Bottom 0.3: v18.5,13.75 18.25,13.75 16.5,12 16.5,6.5 14.5,4.5 9,4.5 6.25,7.25 6.25,9.25 6.75,9.75 N4.3
N$36  (via drill 0.3)
  Top 0.3: v18.25,12.75 16.25,14.75 16.25,19 U6.11 | v10.75,3 8.25,5.5 8.25,6.5 N4.4
  Bottom 0.3: v18.25,12.75 18.25,6.75 14.5,3 v10.75,3
N$37  (via drill 0.3)
  Top 0.3: v17.5,12 14.75,14.75 14.75,19 U6.10 | v11.5,3.75 10,5.25 10,5.75 N4.5
  Bottom 0.3: v17.5,12 17.5,6.75 14.5,3.75 v11.5,3.75
N$38
  Bottom 0.127: R20.2 3.75,31.5 3.75,32.5 U15.1
N$39  (via drill 0.3)
  Top 0.3: v12.25,18 11.25,19 U7.16
  Bottom 0.3: v12.25,18 12.25,17.25 15.5,14 15.5,7.5 13.75,5.75 11.75,5.75 N4.6
N$40  (via drill 0.3)
  Top 0.3: v10.25,17.5 10,17.75 10,19 U7.15
  Bottom 0.3: v10.25,17.5 10,17.5 8.25,15.75 8.25,13.5 7.75,13 7.75,11.75 N4.7
N$41
  Top 0.3: U7.14 8.75,19 8.75,18 15,11.75 15,10.25 14.5,9.75 N4.8
N$42  (via drill 0.3)
  Top 0.3: v8.25,17.25 7.5,18 7.5,19 U7.13
  Bottom 0.3: v8.25,17.25 9,17.25 10,18.25 10.5,18.25 13.75,15 13.75,11.75 N4.9
N$43
  Top 0.3: U7.12 6.25,19 6.25,18 9.75,14.5 11,14.5 12.5,13 N4.0
N$44
  Bottom 0.61: N2.A 42.7,16 43.1,16.4 43.05,16.4 20K1.1
N$45
  Bottom 0.61: 20K2.1 10.68,15.72 N4.A
N$46
  Bottom 0.61: N3.A 26.66,13.23 20K3.1
N$47
  Bottom 0.127: 13.25,34.75 13.25,35.25 R21.1 | 13.25,34.75 13.25,34.25 R17.2 | 13.25,34.75 11,34.75 U9.8
N$48
  Bottom 0.127: R22.2 12,34.25 11,34.25 U9.9
N$49
  Bottom 0.127: R9.2 2.5,35.5 3.5,35.5 U14.1
N$50
  Top 0.127: U10.3 43.75,9 47,9 49.75,11.75 51.75,11.75 54.5,9 56.25,9 57.25,10 57.75,10 U2.1
N$51
  Top 0.127: U11.3 27.75,9 40.25,9 41.25,10 41.75,10 U10.1
N$52
  Top 0.127: U12.3 11.75,9 24.25,9 25.25,10 25.75,10 U11.1
N$53
  Top 0.127: U7.11 5,19 5,10 7,8 N4.RHDP | N3.RHDP 23,8 14.25,8 N4.LHDP | 34,8 30.25,8 N3.LHDP | 34,8 39,8 N2.RHDP | 34,8 38,4 46,4 50,8 55,8 N1.RHDP
  Bottom 0.127: N1.RHDP 55.25,8.25 62,8.25 N1.LHDP | N2.RHDP 39.25,8.25 46,8.25 N2.LHDP | N3.RHDP 23.25,8.25 30,8.25 N3.LHDP | N4.LHDP 14,8.25 7.25,8.25 N4.RHDP
N$67  (via drill 0.35)
  Top 0.61: U7.9 2.33,20.23 v2.8,20.7 13.5,20.7 | 13.5,20.7 24.5,20.7 | 24.5,20.7 35.6,20.7 | 35.6,20.7 46.5,20.7 | 46.5,20.7 57.2,20.7 57.5,20.4 57.5,19.16 U1.9 | U3.9 46.52,20.68 46.5,20.7 | U4.9 35.55,20.64 35.6,20.7 | U6.9 13.47,20.68 13.5,20.7 | U5.9 24.57,20.62 24.5,20.7
  Bottom 0.3: 5.5,22.14 5.5,25.75 D13.C
  Bottom 0.61: v2.8,20.7 4.24,22.14 5.5,22.14 40K1.2
N$80
  pour Bottom: 23.1,40.7 23.7,40.7 24.1,41.1 24.3,41.3 24.3,42.2 27,42.2 27,40.7 26.8,40.5 23.1,40.5
N$95
  Bottom 0.254: R12.2 28.91,39.02 U8.55
RST
  Bottom 0.127: C25.1 62.5,42.5 61.75,42.5 R15.1 61.5,42.5 61.5,43 60.5,44 RESET.2 60.25,44 60.25,42.5 | 60.25,42.5 60.25,39.5 62.75,37 63.5,37 U13.3 | 29.25,42.5 30.75,41 30.75,39.5 U8.56 | 29.25,42.5 25.5,46.25 9.75,46.25 3.75,40.25 3.75,36.5 4,36.25 4,35.25 3.25,34.5 3.25,34 U15.3 | 29.25,42.5 60.25,42.5
RTS  (via drill 0.2)
  Top 0.127: v2.5,33.5 v5.25,30.75
  Bottom 0.127: R9.1 2.5,34.25 v2.5,33.5 2.5,33 2.75,32.75 U15.2 | v5.25,30.75 5.25,32.25 5.75,32.75 6.25,32.75 U9.24
RXD  (via drill 0.2)
  Top 0.127: v5.25,34.75 5.25,35.5 6,36.25 21.85,36.25 24.85,39.25 38.75,39.25 43.25,34.75 v44.75,34.75
  Bottom 0.127: v5.25,34.75 5.25,34.5 6,33.75 6.25,33.75 U9.26 | v44.75,34.75 46.25,34.75 46.5,34.5 U13.34
SCL  (via drill 0.2)
  Top 0.127: v42.25,32 39.25,35 v37,35
  Bottom 0.127: 36.25,39.5 36.75,39 38.25,39 U8.2 | 36.25,39.5 35,40.75 35,41 R3.1 | U13.30 45.5,29.25 42.75,32 v42.25,32 | v37,35 36.25,35.75 36.25,39.5
SDA  (via drill 0.2)
  Top 0.127: v42.25,38.5 v43.5,37.25
  Bottom 0.127: R2.1 36,41 36.75,41 38.25,39.5 U8.1 38.5,39.5 40.25,39.5 41.25,38.5 v42.25,38.5 | v43.5,37.25 43.5,33 45.75,30.75 46.5,30.75 U13.31
TXD  (via drill 0.2)
  Top 0.127: v7.75,38 23,38 25.5,40.5 43.25,40.5 v44.5,39.25
  Bottom 0.127: v7.75,38 4.5,34.75 6,33.25 6.25,33.25 U9.25 | v44.5,39.25 44.5,37 45.75,35.75 46.5,35.75 U13.35
VBUS
  Bottom 0.305: J4.A4 7.53,39.53 7.78,39.78 J4.B9 7.78,40.68 8.78,41.68 9.63,41.68 10.31,41 | J4.A9 10.53,39.47 10.28,39.72 J4.B4 10.28,41 10.31,41 | 10.31,41 14.86,41 F1.1
VDD  (via drill 0.2, 0.35)
  Top 0.127: v12,35.5 v12,32.5
  Bottom 0.127: R2.2 35.75,42 35,42 R3.2 34.75,41.75 34.5,41.75 34.25,41.5 34.25,35.5 37.25,32.5 37.25,31.25 37.5,31 38.25,31 U8.18 | v12,32.5 12,33.25 R22.1 | 10,35.5 v12,35.5 | R15.2 61,42.25 61,40 62.75,38.25 63.5,38.25 U13.2 | 10,35.5 9.5,35.5 U9.6 | 10,35.5 U9.7
  Bottom 0.254: U8.46 29.32,34.52 v29.3,34.5 | U8.18 39.78,31.02 v39.8,31 | U9.7 10.06,36.33 C30.1 10.28,37.38 v10.3,37.4
  Bottom 0.406: U13.2 65.36,38.14 v65.4,38.1
  other vias: 26.8,36.6 25.8,36.6 25.3,37.4 26.3,37.4 27.3,37.4
  pour Bottom: 23.7,36.4 23.7,37.7 23.9,37.9 23.9,38.8 23.8,38.9 23.7,39 23.1,39 23.1,39.2 24.1,39.2 24.2,39.3 28.2,39.3 28.3,39.2 28.3,37.6 26.9,36.2 23.9,36.2
  pour Route15: -0.1,47.1 -0.1,-0.1 69.2,-0.1 69.2,47.1